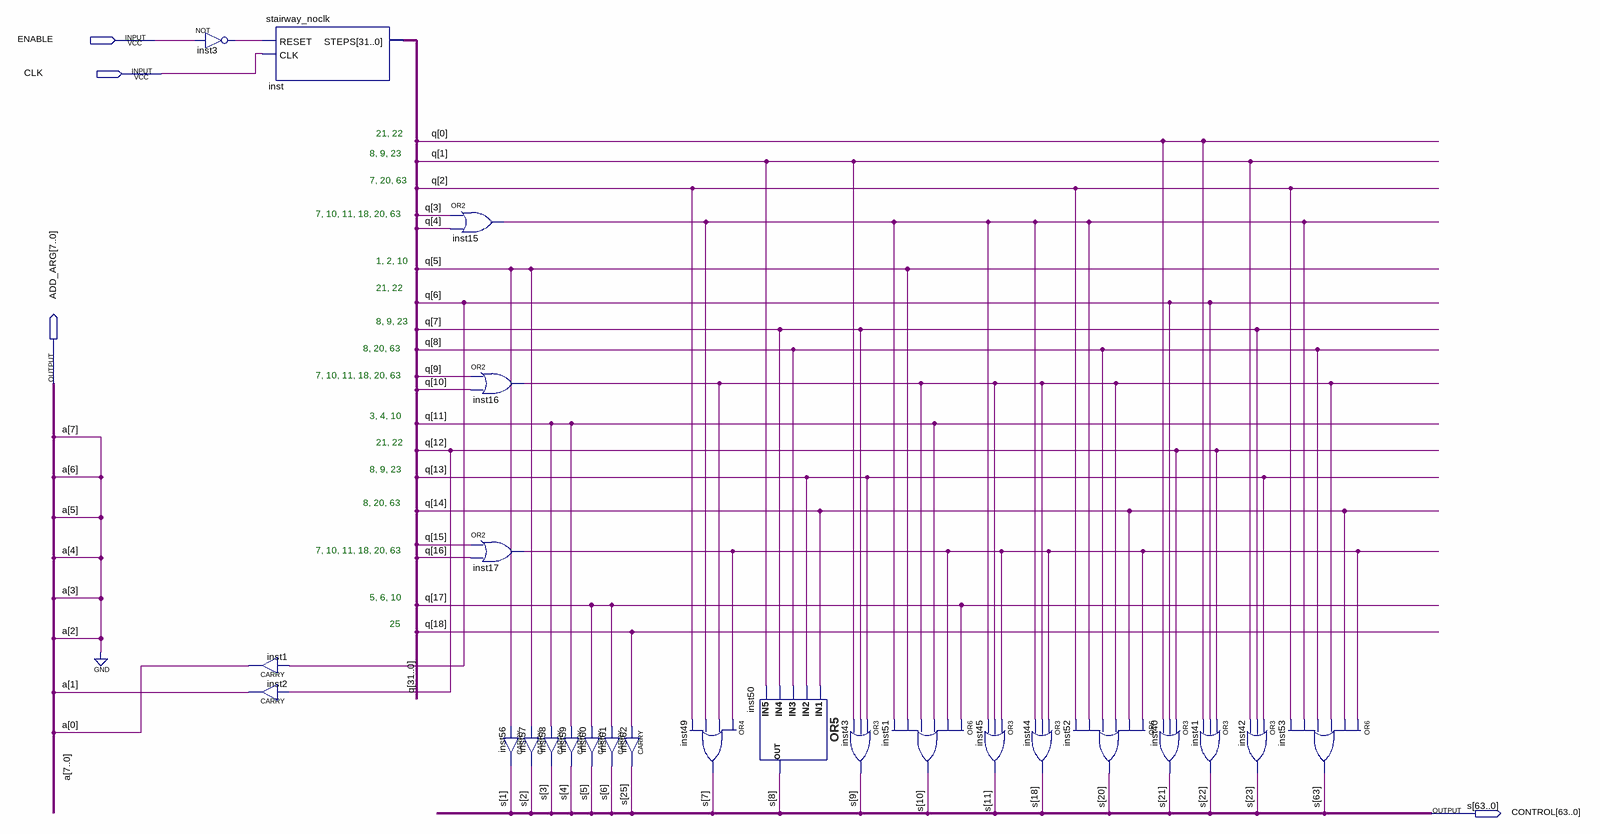
[diagram p0: schematic sheet]
// Quartus schematic macro_load.bdf as structural Verilog: 25 symbols, 4 pins
module macro_load (
  input  ENABLE,
  input  CLK,
  output [7:0] ADD_ARG,
  output [63:0] CONTROL
);

  wire inst3_out, inst15_out, inst16_out, inst17_out;
  wire [31:0] q;

  not inst3 (inst3_out, ENABLE);
  stairway_noclk inst (.RESET(inst3_out), .CLK(CLK), .STEPS(q));
  CARRY inst1 (.IN(q[6]), .OUT(ADD_ARG[0]));
  CARRY inst2 (.IN(q[12]), .OUT(ADD_ARG[1]));
  or inst15 (inst15_out, q[3], q[4]);
  or inst16 (inst16_out, q[9], q[10]);
  or inst17 (inst17_out, q[15], q[16]);
  CARRY inst56 (.IN(q[5]), .OUT(CONTROL[1]));
  CARRY inst57 (.IN(q[5]), .OUT(CONTROL[2]));
  CARRY inst58 (.IN(q[11]), .OUT(CONTROL[3]));
  CARRY inst59 (.IN(q[11]), .OUT(CONTROL[4]));
  CARRY inst60 (.IN(q[17]), .OUT(CONTROL[5]));
  CARRY inst61 (.IN(q[17]), .OUT(CONTROL[6]));
  CARRY inst62 (.IN(q[18]), .OUT(CONTROL[25]));
  or inst49 (CONTROL[7], inst17_out, inst16_out, inst15_out, q[2]);
  or inst50 (CONTROL[8], q[14], q[13], q[8], q[7], q[1]);
  or inst43 (CONTROL[9], q[13], q[7], q[1]);
  or inst51 (CONTROL[10], q[17], inst17_out, q[11], inst16_out, q[5], inst15_out);
  or inst45 (CONTROL[11], inst17_out, inst16_out, inst15_out);
  or inst44 (CONTROL[18], inst17_out, inst16_out, inst15_out);
  or inst52 (CONTROL[20], inst17_out, q[14], inst16_out, q[8], inst15_out, q[2]);
  or inst40 (CONTROL[21], q[12], q[6], q[0]);
  or inst41 (CONTROL[22], q[12], q[6], q[0]);
  or inst42 (CONTROL[23], q[13], q[7], q[1]);
  or inst53 (CONTROL[63], inst17_out, q[14], inst16_out, q[8], inst15_out, q[2]);

  assign ADD_ARG[7:2] = {6{1'b0}};

  // Other names for the same wires on the sheet: a[1:0] = ADD_ARG[1:0]; s[63:0] = CONTROL

  // Notes on the sheet:
  //   21, 22
  //   8, 9, 23
  //   7, 20, 63
  //   7, 10, 11, 18, 20, 63
  //   1, 2, 10
  //   21, 22
  //   8, 9, 23
  //   8, 20, 63
  //   7, 10, 11, 18, 20, 63
  //   3, 4, 10
  //   21, 22
  //   8, 9, 23
  //   8, 20, 63
  //   7, 10, 11, 18, 20, 63
  //   5, 6, 10
  //   25
endmodule
